# EAGLE schematic CurrentController (EAGLE 6.6.0)

## Sheet 1 of 4
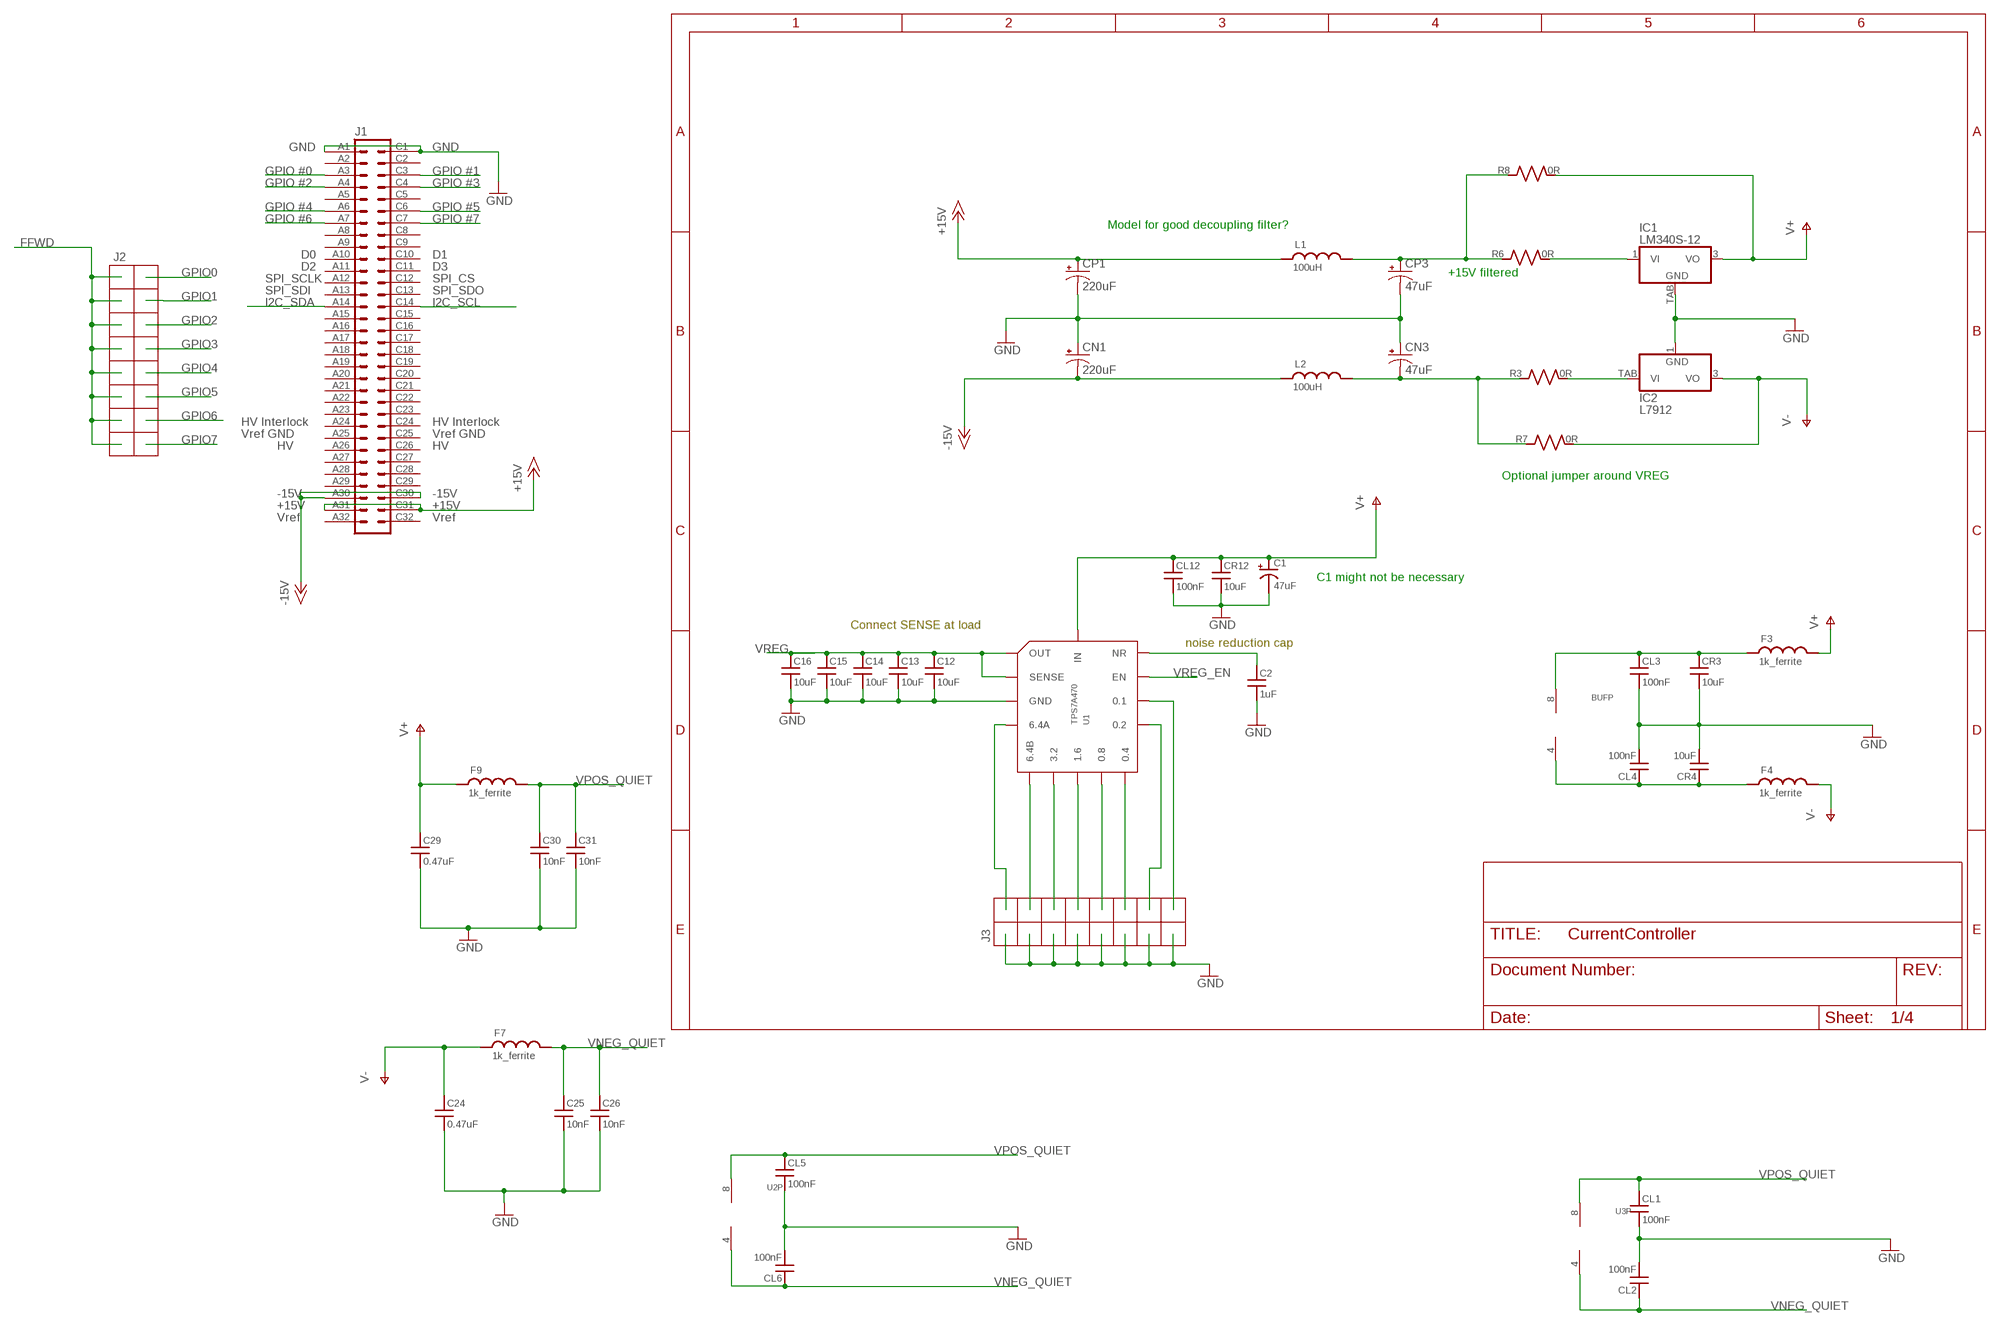
[diagram p0: schematic, sheet 1]

### Parts
BUF  AD8676  DUAL-OPAMP-AD8676_MSOP  [MSOP08]
C1  47uF  C_POL_SMDCPOL_1206  [C_POL_1206]
C2  1uF  C_MLCC_SMDCMLCC_0603  [C_MLCC_0603]
C12  10uF  C_MLCC_SMDCMLCC_0805  [C_MLCC_0805]
C13  10uF  C_MLCC_SMDCMLCC_0805  [C_MLCC_0805]
C14  10uF  C_MLCC_SMDCMLCC_0805  [C_MLCC_0805]
C15  10uF  C_MLCC_SMDCMLCC_0805  [C_MLCC_0805]
C16  10uF  C_MLCC_SMDCMLCC_0805  [C_MLCC_0805]
C24  0.47uF  C_MLCC_SMDCMLCC_0612  [C_MLCC_0612]
C25  10nF  C_MLCC_SMDCMLCC_0306  [C_MLCC_0306]
C26  10nF  C_MLCC_SMDCMLCC_0306  [C_MLCC_0306]
C29  0.47uF  C_MLCC_SMDCMLCC_0612  [C_MLCC_0612]
C30  10nF  C_MLCC_SMDCMLCC_0306  [C_MLCC_0306]
C31  10nF  C_MLCC_SMDCMLCC_0306  [C_MLCC_0306]
CL1  100nF  C_MLCC_SMDCMLCC_0603  [C_MLCC_0603]
CL2  100nF  C_MLCC_SMDCMLCC_0603  [C_MLCC_0603]
CL3  100nF  C_MLCC_SMDCMLCC_0603  [C_MLCC_0603]
CL4  100nF  C_MLCC_SMDCMLCC_0603  [C_MLCC_0603]
CL5  100nF  C_MLCC_SMDCMLCC_0603  [C_MLCC_0603]
CL6  100nF  C_MLCC_SMDCMLCC_0603  [C_MLCC_0603]
CL12  100nF  C_MLCC_SMDCMLCC_0603  [C_MLCC_0603]
CN1  220uF  CPOL-USF  [PANASONIC_F]
CN3  47uF  CPOL-USCT7343  [CT7343]
CP1  220uF  CPOL-USF  [PANASONIC_F]
CP3  47uF  CPOL-USCT7343  [CT7343]
CR3  10uF  C_MLCC_SMDCMLCC_0805  [C_MLCC_0805]
CR4  10uF  C_MLCC_SMDCMLCC_0805  [C_MLCC_0805]
CR12  10uF  C_MLCC_SMDCMLCC_0805  [C_MLCC_0805]
F3  1k_ferrite  L_FERRITE_SMDLFERRITE_0603  [L_FERRITE_0603]
F4  1k_ferrite  L_FERRITE_SMDLFERRITE_0603  [L_FERRITE_0603]
F7  1k_ferrite  L_FERRITE_SMDLFERRITE_0603  [L_FERRITE_0603]
F9  1k_ferrite  L_FERRITE_SMDLFERRITE_0603  [L_FERRITE_0603]
IC1  LM340S-12  [TO263-3]
IC2  L7912  [TO223-3]
J1  VG64C  [VG64-CUTOUT]
J2  2X8_LOW_PROFILE_JUMPER  [2X8_LOW_PROFILE_JUMPER_MATRIX]
J3  2X8_LOW_PROFILE_JUMPER  [2X8_LOW_PROFILE_JUMPER_MATRIX]
L1  100uH  WURTH_74477020  [WURTH_1280]
L2  100uH  WURTH_74477020  [WURTH_1280]
R3  0R  R_SMDR1206  [R_1206]
R6  0R  R_SMDR1206  [R_1206]
R7  0R  R_SMDR1206  [R_1206]
R8  0R  R_SMDR1206  [R_1206]
U1  TPS7A470  [S-PVQFN-N20]
U2  AD8676  DUAL-OPAMP-AD8676_MSOP  [MSOP08]
U3  AD8676  DUAL-OPAMP-AD8676_MSOP  [MSOP08]

### Nets
+15V: CP1.+ J1.A31 J1.C31 L1.P$1
-15V: CN1.- J1.A30 J1.C30 L2.P$1
FFWD: J2.P$1 J2.P$3 J2.P$5 J2.P$7 J2.P$9 J2.P$11 J2.P$13 J2.P$15 ; also sheet 2
GND: C1.P$2(-) C2.P$2 C12.P$2 C13.P$2 C14.P$2 C15.P$2 C16.P$2 C24.P$2 C25.P$2 C26.P$2 C29.P$2 C30.P$2 C31.P$2 CL1.P$2 CL2.P$2 CL3.P$2 CL4.P$2 CL5.P$2 CL6.P$2 CL12.P$2 CN1.+ CN3.+ CP1.- CP3.- CR3.P$2 CR4.P$2 CR12.P$2 IC1.TAB(GND) IC2.1(GND) J1.A1 J1.C1 J3.P$1 J3.P$3 J3.P$5 J3.P$7 J3.P$9 J3.P$11 J3.P$13 J3.P$15 U1.2(GND) U1.7(GND) U1.17(GND) U1.18(GND) U1.19(GND) U1.EXP(GND) ; also sheet 2,3,4
GPIO0: J1.A3 J2.P$2
GPIO1: J1.C3 J2.P$4
GPIO2: J1.A4 J2.P$6
GPIO3: J1.C4 J2.P$8
GPIO4: J1.A6 J2.P$10
GPIO5: J1.C6 J2.P$12
GPIO6: J1.A7 J2.P$14
GPIO7: J1.C7 J2.P$16
N$19: J3.P$2 U1.4(6.4A)
N$24: IC2.TAB(VI) R3.P$2
N$26: IC1.1(VI) R6.P$2
N$27: J3.P$4 U1.5(6.4B)
N$30: CN3.- L2.P$2 R3.P$1 R7.P$1
N$31: J3.P$6 U1.6(3.2)
N$32: CP3.+ L1.P$2 R6.P$1 R8.P$1
N$34: J3.P$8 U1.8(1.6)
N$36: BUF.4(P:V-) CL4.P$1 CR4.P$1 F4.P$1
N$37: BUF.8(P:V+) CL3.P$1 CR3.P$1 F3.P$1
N$39: J3.P$10 U1.9(0.8)
N$41: J3.P$12 U1.10(0.4)
N$43: J3.P$14 U1.11(0.2)
N$44: J3.P$16 U1.12(0.1)
N$45: C2.P$1 U1.14(NR)
SCL: J1.C14 ; also sheet 4
SDA: J1.A14 ; also sheet 4
V+: C1.P$1(+) C29.P$1 CL12.P$1 CR12.P$1 F3.P$2 F9.P$1 IC1.3(VO) R8.P$2 U1.15(IN) U1.16(IN) ; also sheet 3,4
V-: C24.P$1 F4.P$2 F7.P$1 IC2.3(VO) R7.P$2 ; also sheet 3,4
VNEG_QUIET: C25.P$1 C26.P$1 CL2.P$1 CL6.P$1 F7.P$2 U2.4(P:V-) U3.4(P:V-) ; also sheet 2
VPOS_QUIET: C30.P$1 C31.P$1 CL1.P$1 CL5.P$1 F9.P$2 U2.8(P:V+) U3.8(P:V+) ; also sheet 2
VREG: C12.P$1 C13.P$1 C14.P$1 C15.P$1 C16.P$1 U1.1(OUT) U1.3(SENSE) U1.20(OUT) ; also sheet 2,3
VREG_EN: U1.13(EN) ; also sheet 4
Unconnected: J1.A2 J1.A5 J1.A8 J1.A9 J1.A10 J1.A11 J1.A12 J1.A13 J1.A15 J1.A16 J1.A17 J1.A18 J1.A19 J1.A20 J1.A21 J1.A22 J1.A23 J1.A24 J1.A25 J1.A26 J1.A27 J1.A28 J1.A29 J1.A32 J1.C2 J1.C5 J1.C8 J1.C9 J1.C10 J1.C11 J1.C12 J1.C13 J1.C15 J1.C16 J1.C17 J1.C18 J1.C19 J1.C20 J1.C21 J1.C22 J1.C23 J1.C24 J1.C25 J1.C26 J1.C27 J1.C28 J1.C29 J1.C32

### Notes on the sheet
- Model for good decoupling filter?
- +15V filtered
- Optional jumper around VREG
- C1 might not be necessary
- Connect SENSE at load
- noise reduction cap

## Sheet 2 of 4
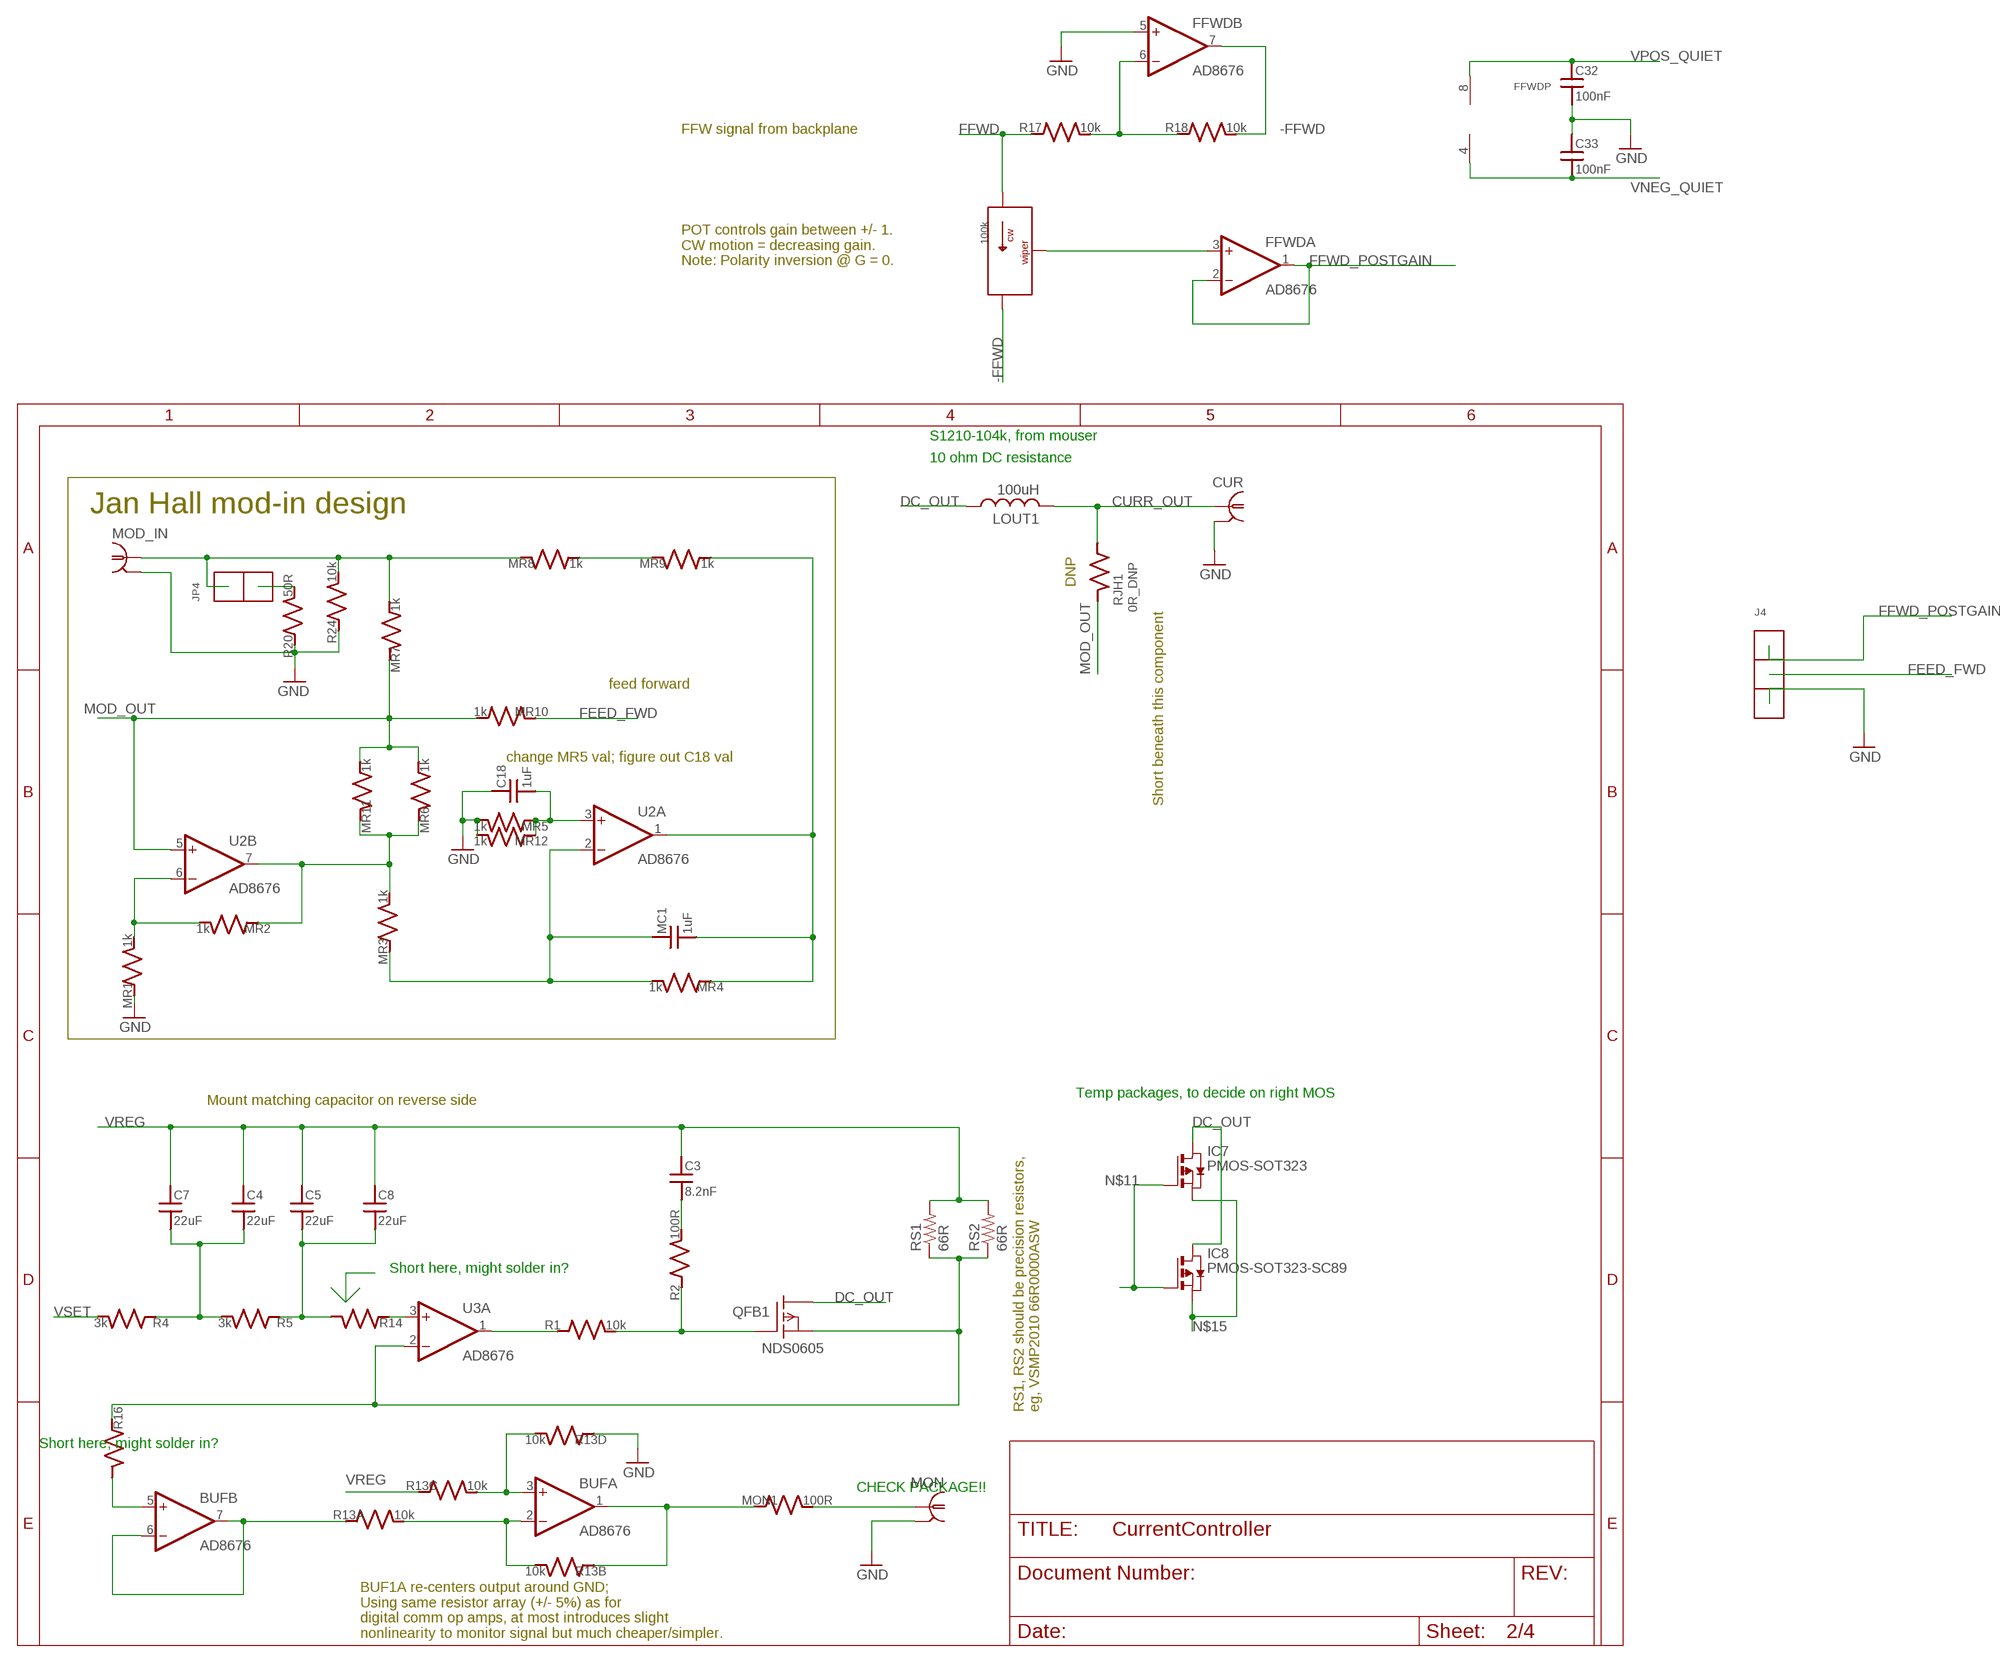
[diagram p1: schematic, sheet 2]

### Parts
C3  8.2nF  C_MLCC_SMDCMLCC_0603  [C_MLCC_0603]
C4  22uF  C_MLCC_SMDCMLCC_0805  [C_MLCC_0805]
C5  22uF  C_MLCC_SMDCMLCC_0805  [C_MLCC_0805]
C7  22uF  C_MLCC_SMDCMLCC_0805  [C_MLCC_0805]
C8  22uF  C_MLCC_SMDCMLCC_0805  [C_MLCC_0805]
C18  1uF  C_MLCC_SMDCMLCC_0603  [C_MLCC_0603]
C32  100nF  C_MLCC_SMDCMLCC_0603  [C_MLCC_0603]
C33  100nF  C_MLCC_SMDCMLCC_0603  [C_MLCC_0603]
CUR  BNC-H  [BNC90]
FFWD  AD8676  DUAL-OPAMP-AD8676_MSOP  [MSOP08]
IC7  PMOS-SOT323  [SOT323]
IC8  PMOS-SOT323-SC89  [SC-89]
J4  1X3_LOW_PROFILE_JUMPER  [1X3_LOW_PROFILE]
JP4  1X2_LOW_PROFILE_JUMPER  [1X2_LOW_PROFILE]
LOUT1  100uH  L-USL3225P  [L3225P]
MC1  1uF  C_MLCC_SMDCMLCC_0603  [C_MLCC_0603]
MOD_IN  BNC-H  [BNC90]
MON  UMC  [UMC]
MON1  100R  R_SMDR0603  [R_0603]
MR1  1k  R_SMDR0805  [R_0805]
MR2  1k  R_SMDR0805  [R_0805]
MR3  1k  R_SMDR0805  [R_0805]
MR4  1k  R_SMDR0805  [R_0805]
MR5  1k  R_SMDR0805  [R_0805]
MR6  1k  R_SMDR0805  [R_0805]
MR7  1k  R_SMDR0805  [R_0805]
MR8  1k  R_SMDR0805  [R_0805]
MR9  1k  R_SMDR0805  [R_0805]
MR10  1k  R_SMDR0805  [R_0805]
MR11  1k  R_SMDR0805  [R_0805]
MR12  1k  R_SMDR0805  [R_0805]
QFB1  NDS0605  [SOT-23]
R1  10k  R_SMDR0603  [R_0603]
R2  100R  R_SMDR0603  [R_0603]
R4  3k  R_SMDR0603  [R_0603]
R5  3k  R_SMDR0603  [R_0603]
R13  10k  R_ARRAY  [742_ARRAY]
R14  R_SMDR0603  [R_0603]
R16  R_SMDR0603  [R_0603]
R17  10k  R_SMDR0603  [R_0603]
R18  10k  R_SMDR0603  [R_0603]
R20  50R  R_SMDR0805  [R_0805]
R24  10k  R_SMDR0603  [R_0603]
RJH1  0R_DNP  R_SMDR0603  [R_0603]
RS1  66R  R-US_R2010  [R2010]
RS2  66R  R-US_R2010  [R2010]
T1  100k  BOURNS-3006P  [3006P]

### Nets
-FFWD: FFWD.7(B:OUT) R18.P$2 T1.P$3
CURR_OUT: CUR.1 LOUT1.2 RJH1.P$1
DC_OUT: IC7.3(D) IC8.P$3(D) LOUT1.1 QFB1.3(D)
FEED_FWD: J4.P2 MR10.P$1
FFWD: R17.P$1 T1.P$1 ; also sheet 1
FFWD_POSTGAIN: FFWD.1(A:OUT) FFWD.2(A:-IN) J4.P1
GND: C18.P$1 C32.P$2 C33.P$1 CUR.2 FFWD.5(B:+IN) J4.P3 MOD_IN.2 MON.P$2 MON.P$3 MR1.P$1 MR5.P$2 MR12.P$2 R13.P$7 R20.P$1 R24.P$1 ; also sheet 1,3,4
MOD_OUT: MR6.P$2 MR7.P$1 MR10.P$2 MR11.P$2 RJH1.P$2 U2.5(B:+IN)
MODIN_B: JP4.1 MOD_IN.1 MR7.P$2 MR8.P$1 R24.P$2
MON: BUF.1(A:OUT) MON1.P$1 R13.P$3
MON_MON: MON1.P$2 MON.P$1
N$1: MR8.P$2 MR9.P$1
N$4: BUF.6(B:-IN) BUF.7(B:OUT) R13.P$1
N$6: BUF.5(B:+IN) R16.P$2
N$7: FFWD.3(A:+IN) T1.P$2
N$8: C4.P$2 C7.P$2 R4.P$1 R5.P$2
N$9: C5.P$2 C8.P$2 R5.P$1 R14.P$2
N$10: R1.P$1 U3.1(A:OUT)
N$11: IC7.1(G) IC8.P$1(G) QFB1.1(G) R1.P$2 R2.P$1
N$12: R14.P$1 U3.3(A:+IN)
N$13: C3.P$2 R2.P$2
N$14: BUF.2(A:-IN) R13.P$2 R13.P$4
N$15: IC7.2(S) IC8.P$2(S) QFB1.2(S) R16.P$1 RS1.1 RS2.1 U3.2(A:-IN)
N$17: BUF.3(A:+IN) R13.P$6 R13.P$8
N$18: MR1.P$2 MR2.P$2 U2.6(B:-IN)
N$20: MR2.P$1 MR3.P$2 MR6.P$1 MR11.P$1 U2.7(B:OUT)
N$21: C18.P$2 MR5.P$1 MR12.P$1 U2.3(A:+IN)
N$23: MC1.P$2 MR4.P$1 MR9.P$2 U2.1(A:OUT)
N$25: MC1.P$1 MR3.P$1 MR4.P$2 U2.2(A:-IN)
N$35: JP4.2 R20.P$2
N$38: FFWD.6(B:-IN) R17.P$2 R18.P$1
VNEG_QUIET: C33.P$2 FFWD.4(P:V-) ; also sheet 1
VPOS_QUIET: C32.P$1 FFWD.8(P:V+) ; also sheet 1
VREG: C3.P$1 C4.P$1 C5.P$1 C7.P$1 C8.P$1 R13.P$5 RS1.2 RS2.2 ; also sheet 1,3
VSET: R4.P$2 ; also sheet 3

### Notes on the sheet
- FFW signal from backplane
- POT controls gain between +/- 1.
  CW motion = decreasing gain.
  Note: Polarity inversion @ G = 0.
- S1210-104k, from mouser
- 10 ohm DC resistance
- Jan Hall mod-in design
- DNP
- feed forward
- change MR5 val; figure out C18 val
- Short beneath this component
- Temp packages, to decide on right MOS
- Mount matching capacitor on reverse side
- Short here, might solder in?
- RS1, RS2 should be precision resistors,
  eg, VSMP2010 66R0000ASW
- Short here, might solder in?
- CHECK PACKAGE!!
- BUF1A re-centers output around GND;
  Using same resistor array (+/- 5%) as for 
  digital comm op amps, at most introduces slight 
  nonlinearity to monitor signal but much cheaper/simpler.

## Sheet 3 of 4
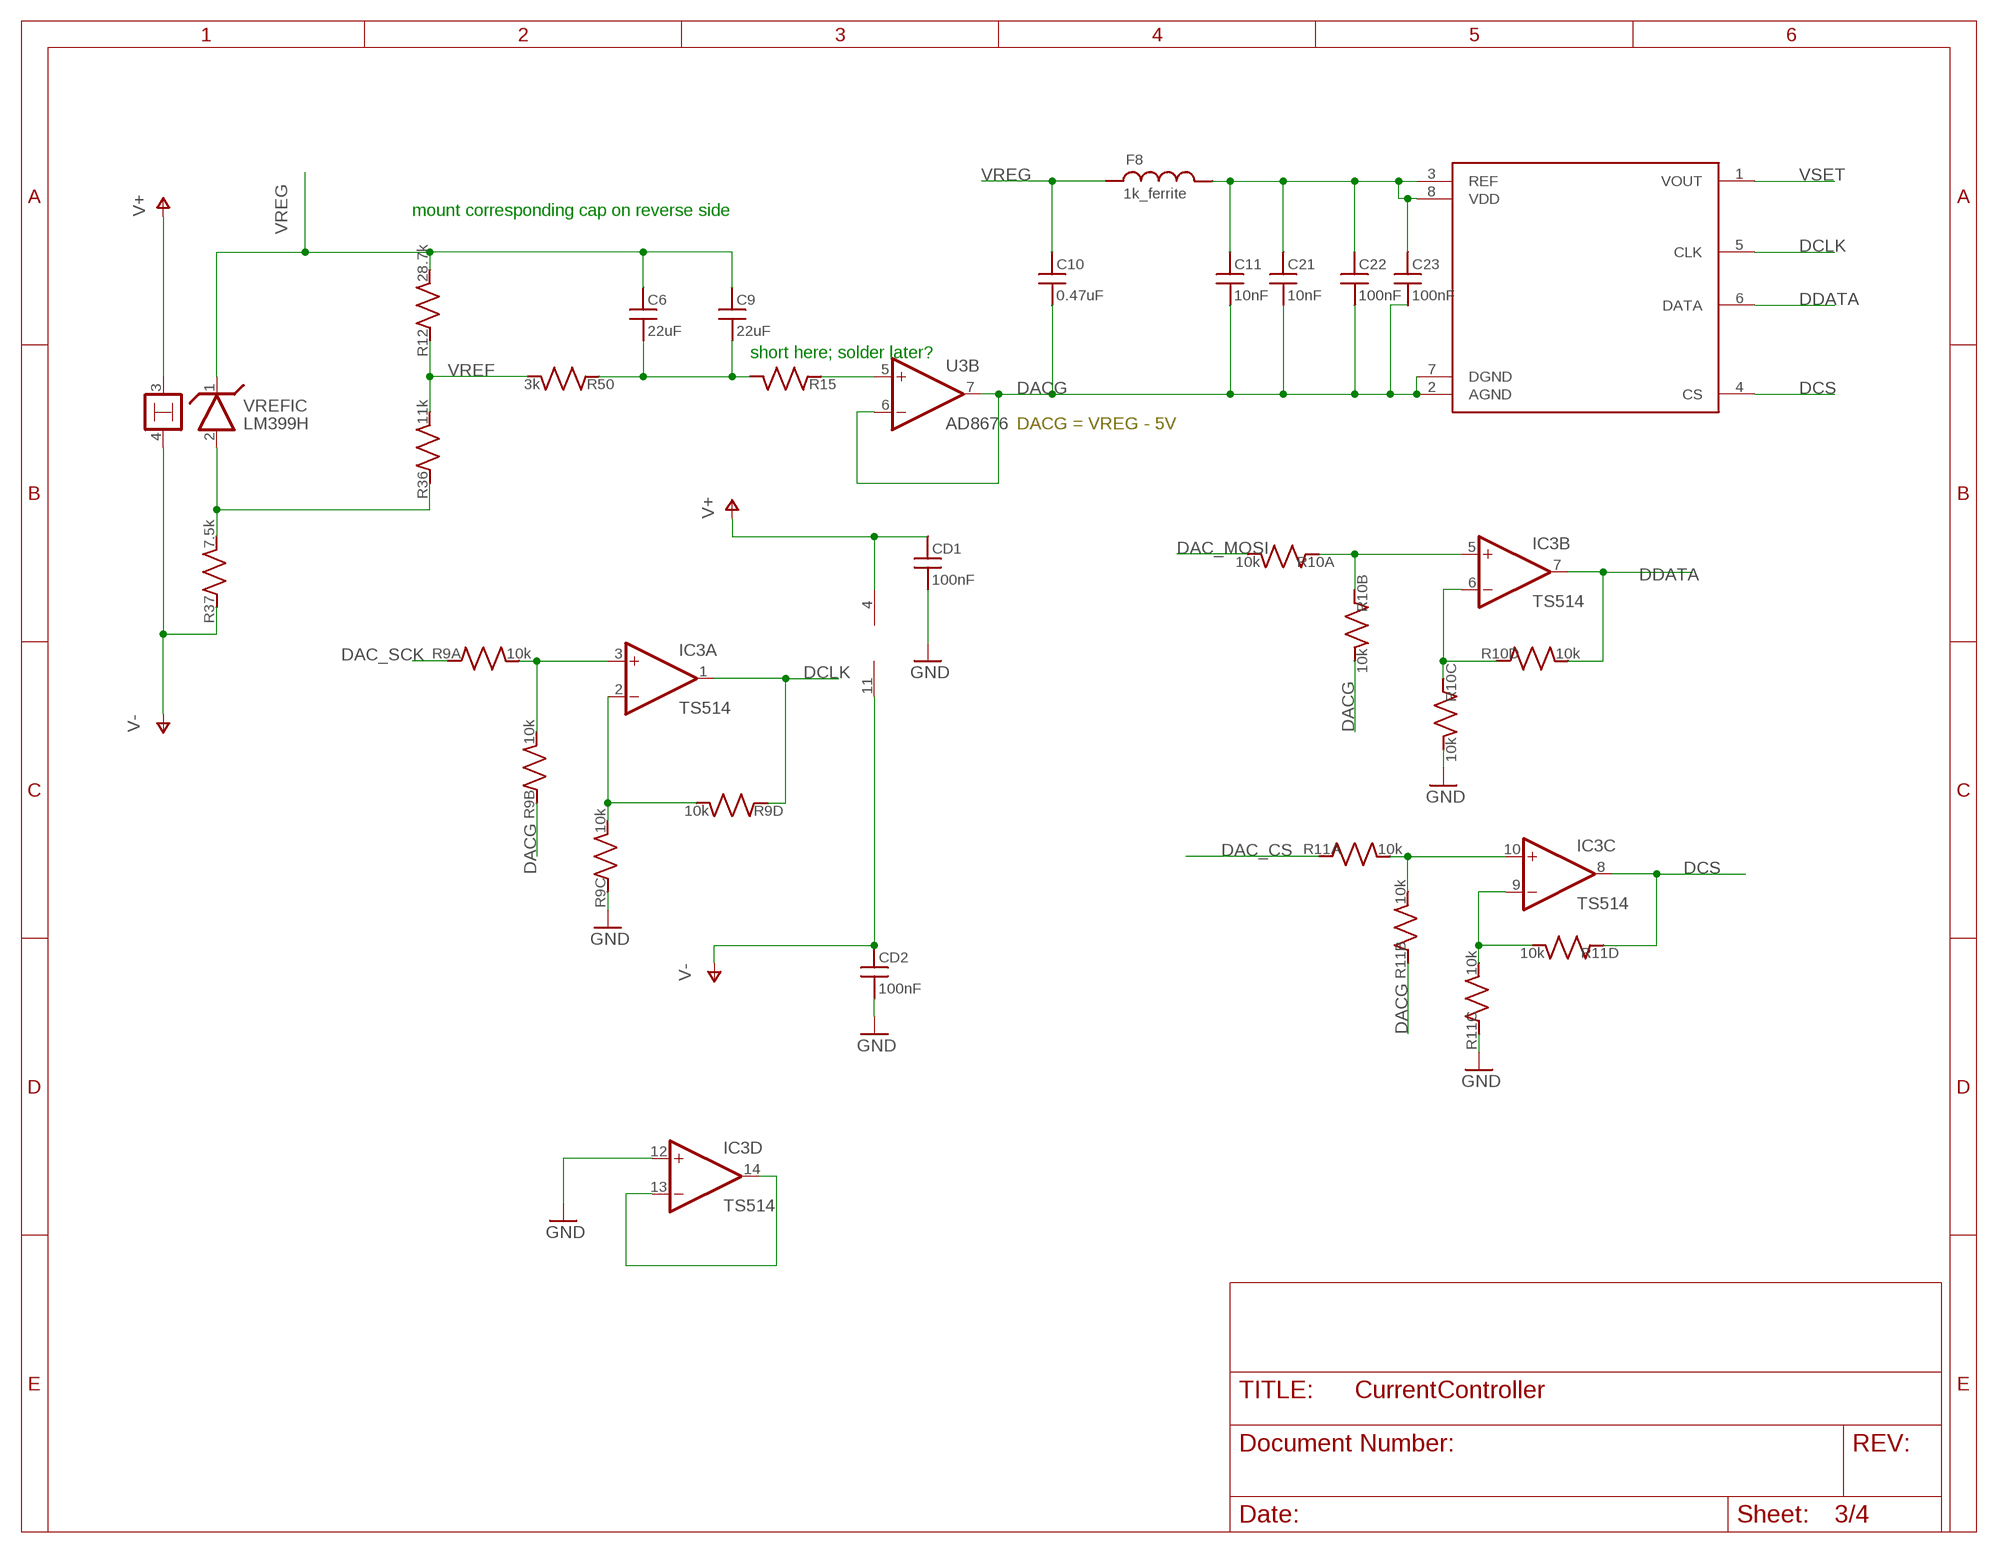
[diagram p2: schematic, sheet 3]

### Parts
C6  22uF  C_MLCC_SMDCMLCC_0805  [C_MLCC_0805]
C9  22uF  C_MLCC_SMDCMLCC_0805  [C_MLCC_0805]
C10  0.47uF  C_MLCC_SMDCMLCC_0612  [C_MLCC_0612]
C11  10nF  C_MLCC_SMDCMLCC_0306  [C_MLCC_0306]
C21  10nF  C_MLCC_SMDCMLCC_0306  [C_MLCC_0306]
C22  100nF  C_MLCC_SMDCMLCC_0603  [C_MLCC_0603]
C23  100nF  C_MLCC_SMDCMLCC_0603  [C_MLCC_0603]
CD1  100nF  C_MLCC_SMDCMLCC_0603  [C_MLCC_0603]
CD2  100nF  C_MLCC_SMDCMLCC_0603  [C_MLCC_0603]
DAC1  AD5541  [SOIC-8]
F8  1k_ferrite  L_FERRITE_SMDLFERRITE_0603  [L_FERRITE_0603]
IC3  TS514  4AMP_P4+11D  [SO14]
R9  10k  R_ARRAY  [742_ARRAY]
R10  10k  R_ARRAY  [742_ARRAY]
R11  10k  R_ARRAY  [742_ARRAY]
R12  28.7k  R_SMDR0603  [R_0603]
R15  R_SMDR0603  [R_0603]
R36  11k  R_SMDR0603  [R_0603]
R37  7.5k  R_SMDR0603  [R_0603]
R50  3k  R_SMDR0603  [R_0603]
VREFIC  LM399H  [TO39/4]

### Nets
DAC_CS: R11.P$1 ; also sheet 4
DAC_MOSI: R10.P$2 ; also sheet 4
DAC_SCK: R9.P$1 ; also sheet 4
DACG: C10.P$2 C11.P$2 C21.P$2 C22.P$2 C23.P$2 DAC1.2(AGND) DAC1.7(DGND) R9.P$3 R10.P$4 R11.P$3 U3.6(B:-IN) U3.7(B:OUT)
DCLK: DAC1.5(CLK) IC3.1(A:OUT) R9.P$7
DCS: DAC1.4(CS) IC3.8(C:OUT) R11.P$7
DDATA: DAC1.6(DATA) IC3.7(B:OUT) R10.P$8
GND: CD1.P$2 CD2.P$2 IC3.12(D:+IN) R9.P$5 R10.P$6 R11.P$5 ; also sheet 1,2,4
N$3: IC3.9(C:-IN) R11.P$6 R11.P$8
N$16: IC3.2(A:-IN) R9.P$6 R9.P$8
N$28: R36.P$1 R37.P$2 VREFIC.2
N$29: R15.P$1 U3.5(B:+IN)
N$40: IC3.3(A:+IN) R9.P$2 R9.P$4
N$42: IC3.5(B:+IN) R10.P$1 R10.P$3
N$47: IC3.6(B:-IN) R10.P$5 R10.P$7
N$48: C6.P$2 C9.P$2 R15.P$2 R50.P$1
N$49: IC3.10(C:+IN) R11.P$2 R11.P$4
N$51: IC3.13(D:-IN) IC3.14(D:OUT)
V+: CD1.P$1 IC3.4(P:V+) VREFIC.3 ; also sheet 1,4
V-: CD2.P$1 IC3.11(P:V-) R37.P$1 VREFIC.4 ; also sheet 1,4
VREF: R12.P$1 R36.P$2 R50.P$2
VREG: C6.P$1 C9.P$1 C10.P$1 F8.P$1 R12.P$2 VREFIC.1 ; also sheet 1,2
VREG_DAC: C11.P$1 C21.P$1 C22.P$1 C23.P$1 DAC1.3(REF) DAC1.8(VDD) F8.P$2
VSET: DAC1.1(VOUT) ; also sheet 2

### Notes on the sheet
- mount corresponding cap on reverse side
- short here; solder later?
- DACG = VREG - 5V

## Sheet 4 of 4
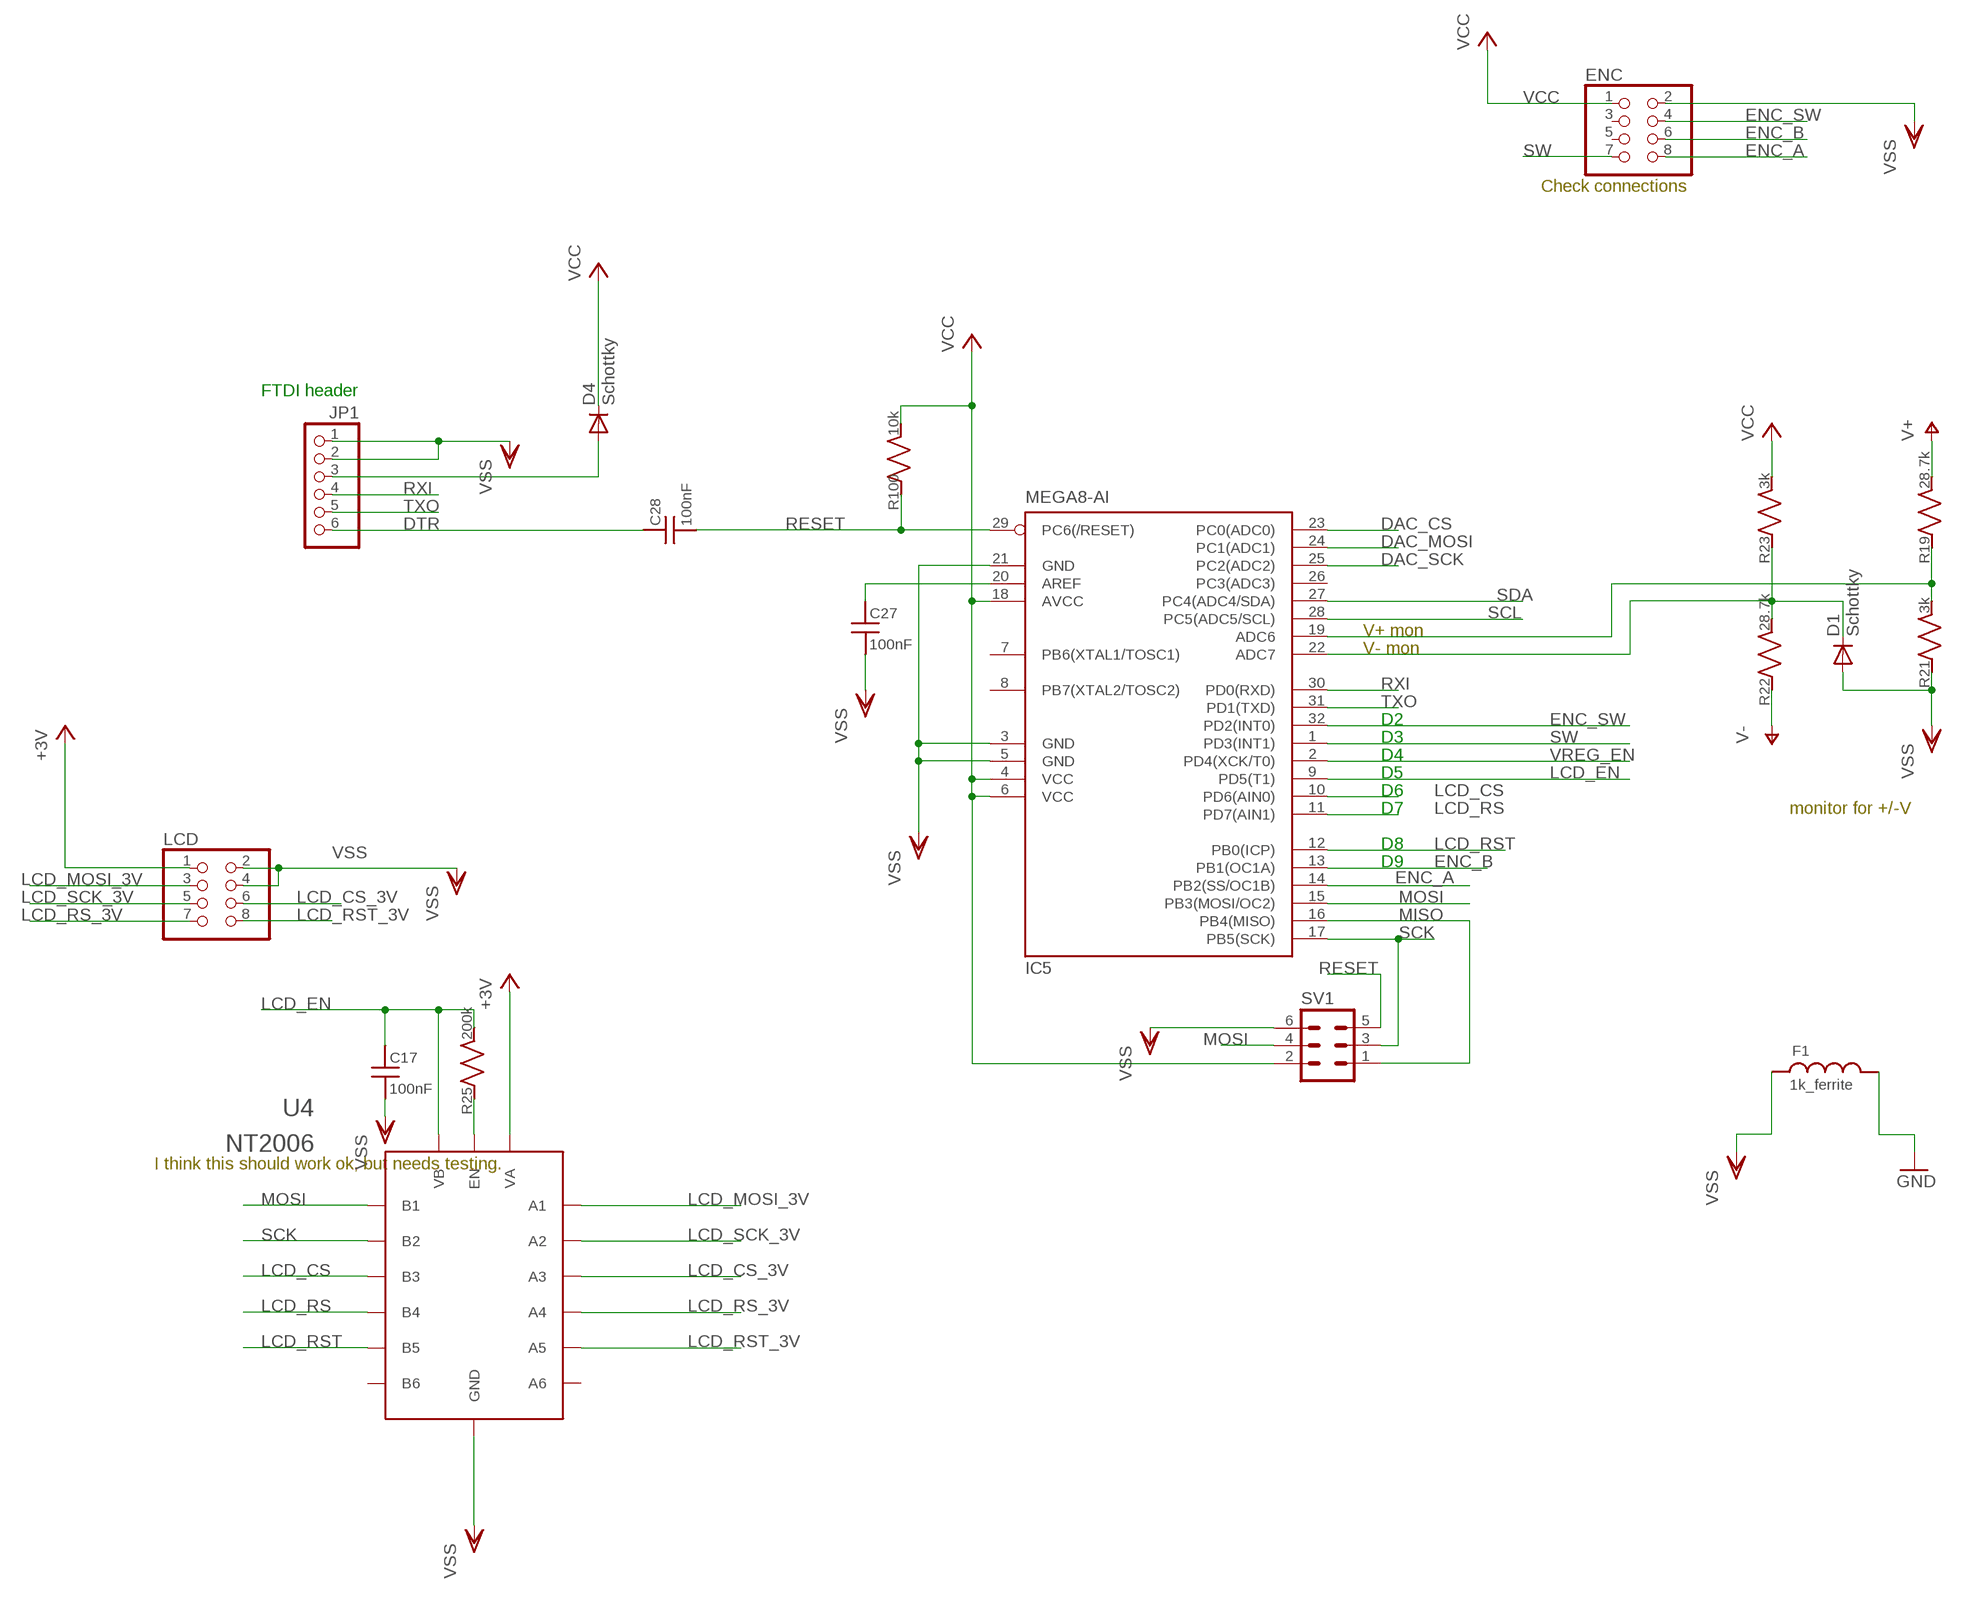
[diagram p3: schematic, sheet 4, part 1 of 2]
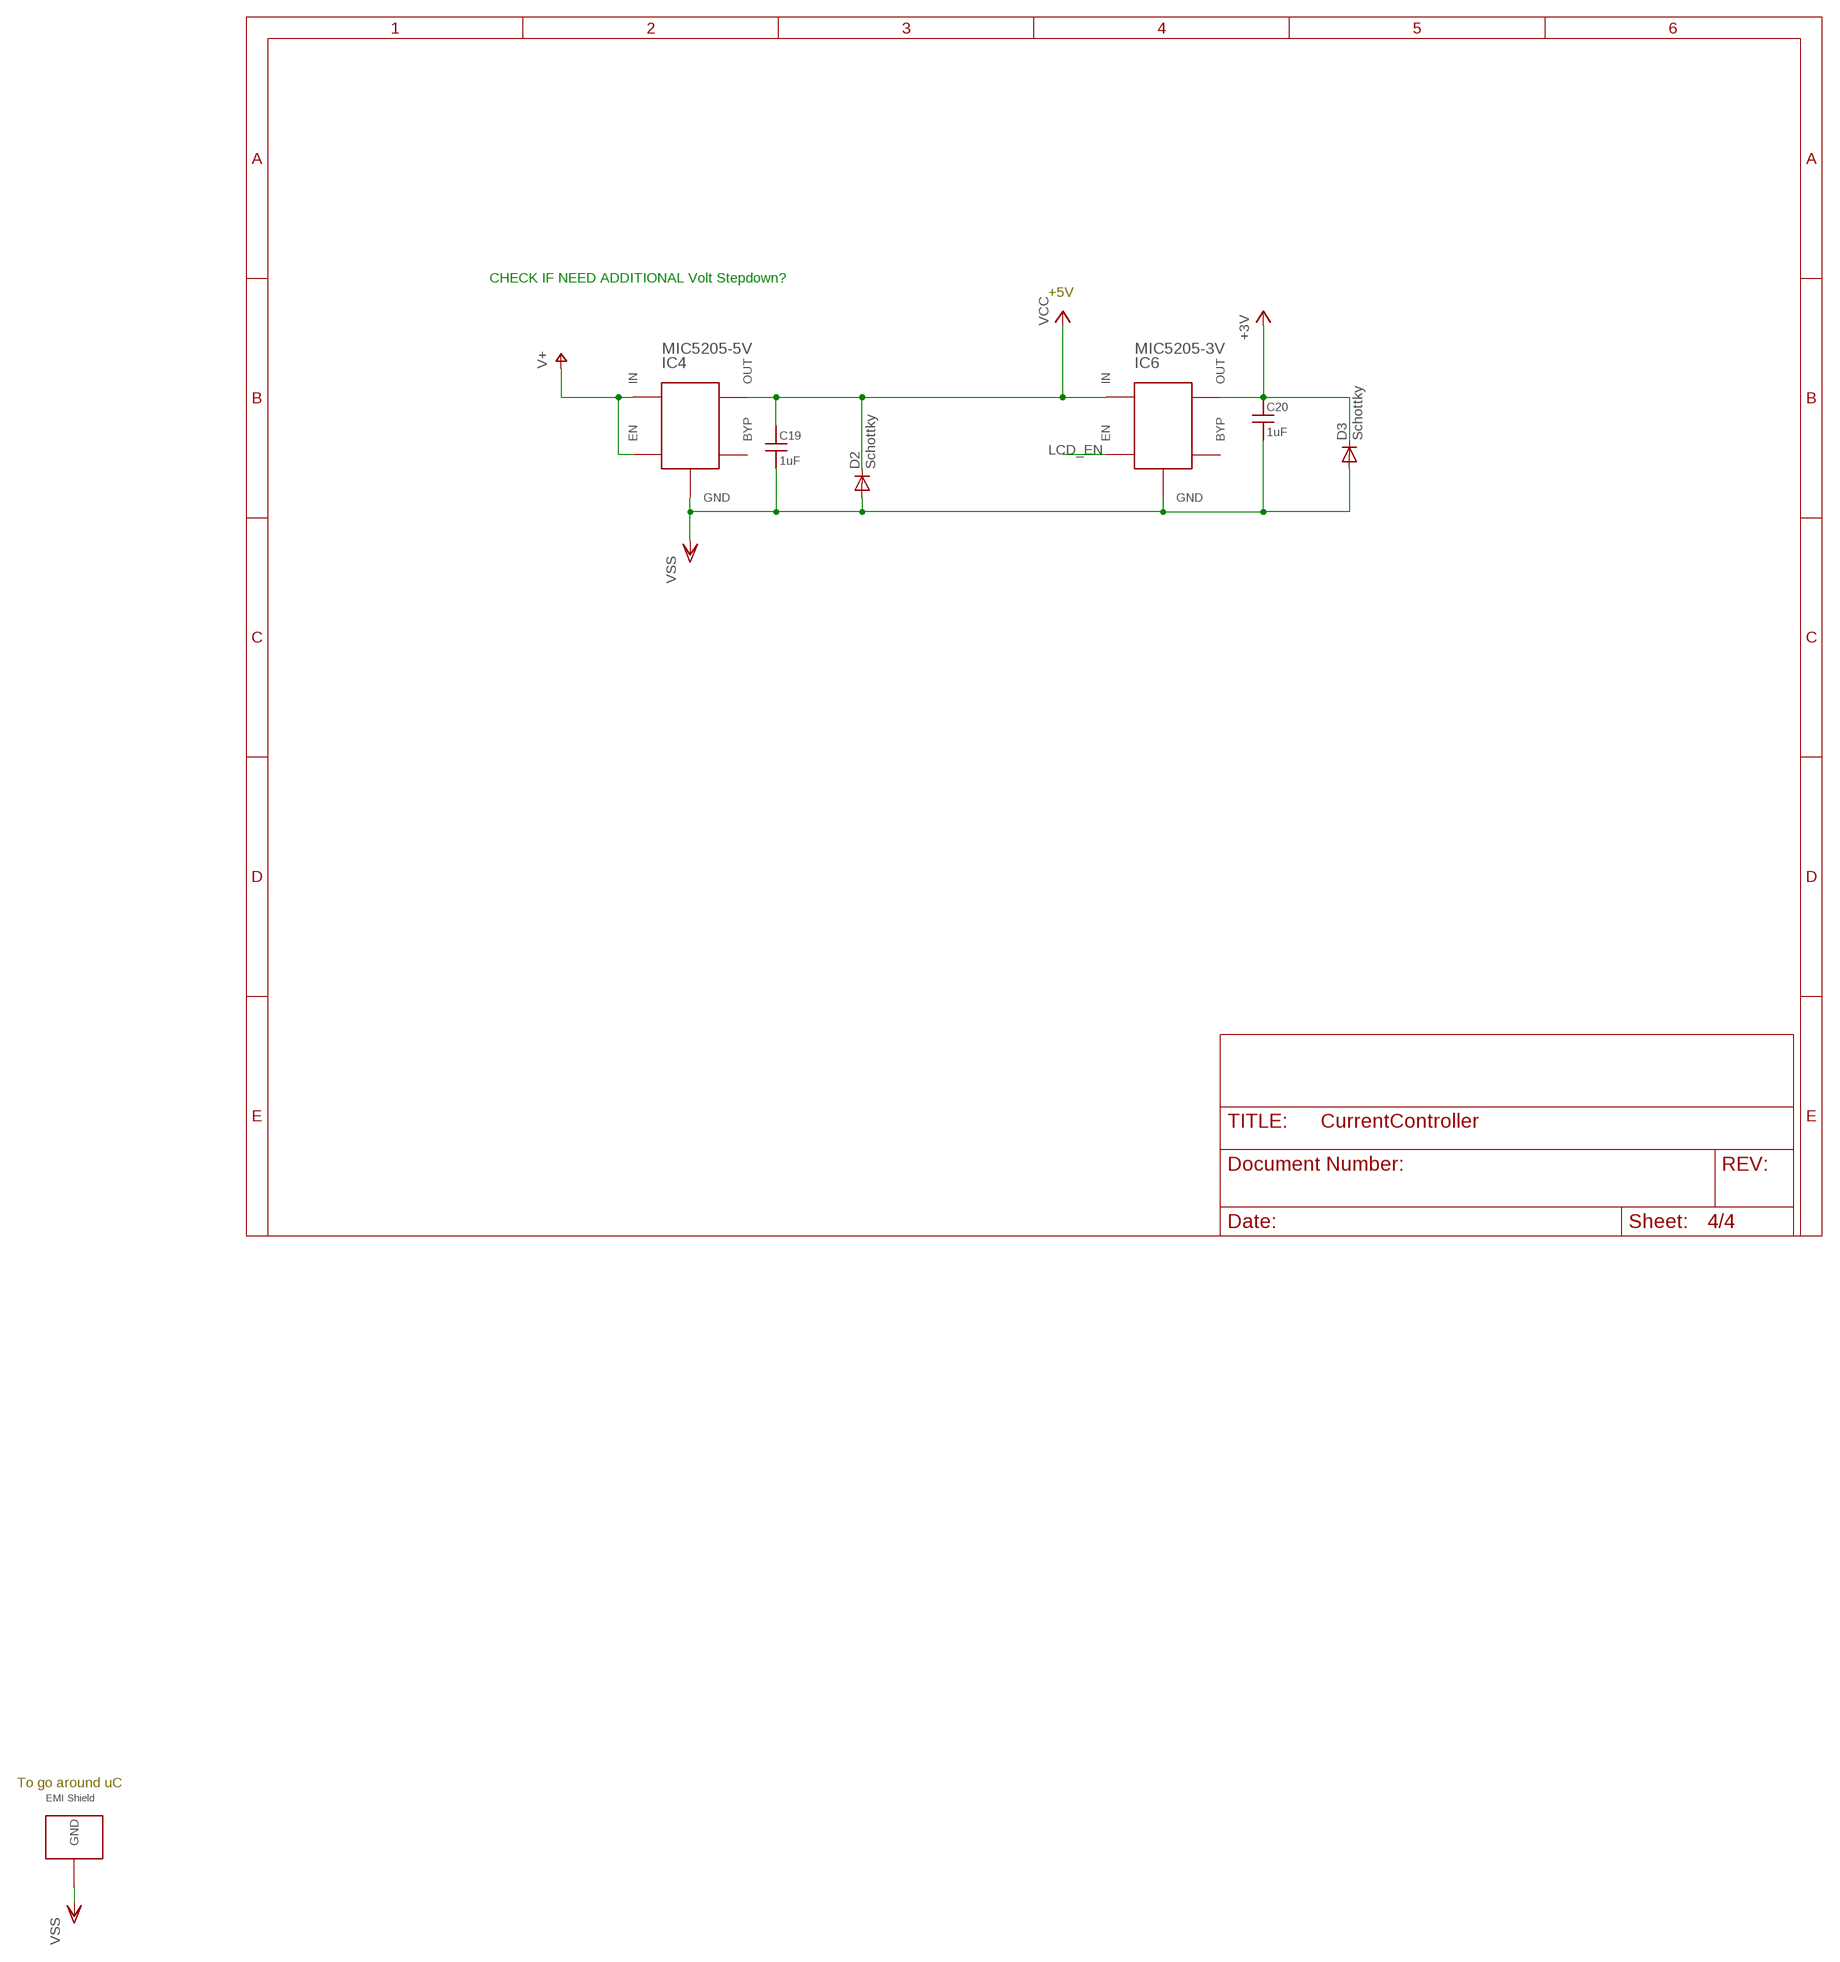
[diagram p4: schematic, sheet 4, part 2 of 2]

### Parts
C17  100nF  C_MLCC_SMDCMLCC_0603  [C_MLCC_0603]
C19  1uF  C_MLCC_SMDCMLCC_0603  [C_MLCC_0603]
C20  1uF  C_MLCC_SMDCMLCC_0603  [C_MLCC_0603]
C27  100nF  C_MLCC_SMDCMLCC_0603  [C_MLCC_0603]
C28  100nF  C_MLCC_SMDCMLCC_0603  [C_MLCC_0603]
D1  Schottky  DIODE-SOD523  [SOD523]
D2  Schottky  DIODE-SOD523  [SOD523]
D3  Schottky  DIODE-SOD523  [SOD523]
D4  Schottky  DIODE-SOD523  [SOD523]
ENC  PINHD-2X4-SHROUD  [ML08]
F1  1k_ferrite  L_FERRITE_SMDLFERRITE_0603  [L_FERRITE_0603]
IC4  MIC5205-5V  MIC5205  [SOT23-5L]
IC5  MEGA8-AI  [TQFP32-08]
IC6  MIC5205-3V  MIC5205  [SOT23-5L]
JP1  PINHD-1X6  [1X06]
LCD  PINHD-2X4-SHROUD  [ML08]
R19  28.7k  R_SMDR0603  [R_0603]
R21  3k  R_SMDR0603  [R_0603]
R22  28.7k  R_SMDR0603  [R_0603]
R23  3k  R_SMDR0603  [R_0603]
R25  200k  R_SMDR0603  [R_0603]
R100  10k  R_SMDR0603  [R_0603]
SV1  MA03-2  [MA03-2]
U4  NT2006  [HVQFN16]
U$5  WURTH_EMI  [WURTH_SHIELD]

### Nets
+3V: C20.P$1 D3.C IC6.5(OUT) LCD.1 U4.16(VA)
A6: IC5.19(ADC6) R19.P$1 R21.P$2
A7: D1.C IC5.22(ADC7) R22.P$2 R23.P$1
DAC_CS: IC5.23(PC0(ADC0)) ; also sheet 3
DAC_MOSI: IC5.24(PC1(ADC1)) ; also sheet 3
DAC_SCK: IC5.25(PC2(ADC2)) ; also sheet 3
DTR: C28.P$1 JP1.6
ENC_A: ENC.8 IC5.14(PB2(SS/OC1B))
ENC_B: ENC.6 IC5.13(PB1(OC1A))
ENC_SW: ENC.4 IC5.32(PD2(INT0))
GND: F1.P$2 ; also sheet 1,2,3
LCD_CS: IC5.10(PD6(AIN0)) U4.10(B3)
LCD_CS_3V: LCD.6 U4.3(A3)
LCD_EN: C17.P$1 IC5.9(PD5(T1)) IC6.3(EN) R25.P$2 U4.13(VB)
LCD_MOSI_3V: LCD.3 U4.1(A1)
LCD_RS: IC5.11(PD7(AIN1)) U4.9(B4)
LCD_RS_3V: LCD.7 U4.4(A4)
LCD_RST: IC5.12(PB0(ICP)) U4.8(B5)
LCD_RST_3V: LCD.8 U4.5(A5)
LCD_SCK_3V: LCD.5 U4.2(A2)
MISO: IC5.16(PB4(MISO)) SV1.1
MOSI: IC5.15(PB3(MOSI/OC2)) SV1.4 U4.12(B1)
N$2: D4.A JP1.3
N$5: C27.P$1 IC5.20(AREF)
N$22: R25.P$1 U4.14(EN)
RESET: C28.P$2 IC5.29(PC6(/RESET)) R100.P$1 SV1.5
RXI: IC5.30(PD0(RXD)) JP1.4
SCK: IC5.17(PB5(SCK)) SV1.3 U4.11(B2)
SCL: IC5.28(PC5(ADC5/SCL)) ; also sheet 1
SDA: IC5.27(PC4(ADC4/SDA)) ; also sheet 1
SW: ENC.7 IC5.1(PD3(INT1))
TXO: IC5.31(PD1(TXD)) JP1.5
V+: IC4.1(IN) IC4.3(EN) R19.P$2 ; also sheet 1,3
V-: R22.P$1 ; also sheet 1,3
VCC: C19.P$1 D2.C D4.C ENC.1 IC4.5(OUT) IC5.4(VCC) IC5.6(VCC) IC5.18(AVCC) IC6.1(IN) R23.P$2 R100.P$2 SV1.2
VREG_EN: IC5.2(PD4(XCK/T0)) ; also sheet 1
VSS: C17.P$2 C19.P$2 C20.P$2 C27.P$2 D1.A D2.A D3.A ENC.2 F1.P$1 IC4.2(GND) IC5.3(GND) IC5.5(GND) IC5.21(GND) IC6.2(GND) JP1.1 JP1.2 LCD.2 LCD.4 R21.P$1 SV1.6 U4.15(GND) U4.P$17(GND) U$5.P$1(GND) U$5.P$2(GND) U$5.P$3(GND) U$5.P$4(GND) U$5.P$5(GND) U$5.P$6(GND) U$5.P$7(GND) U$5.P$8(GND) U$5.P$9(GND) U$5.P$10(GND) U$5.P$11(GND) U$5.P$12(GND) U$5.P$13(GND) U$5.P$14(GND) U$5.P$15(GND) U$5.P$16(GND)
Unconnected: ENC.3 ENC.5 IC4.4(BYP) IC5.7(PB6(XTAL1/TOSC1)) IC5.8(PB7(XTAL2/TOSC2)) IC5.26(PC3(ADC3)) IC6.4(BYP) U4.6(A6) U4.7(B6)

### Notes on the sheet
- CHECK IF NEED ADDITIONAL Volt Stepdown?
- +5V
- Check connections
- FTDI header
- To go around uC
- V+ mon
- V- mon
- D2
- D3
- D4
- D5
- D6
- D7 | monitor for +/-V
- D8
- D9
- I think this should work ok, but needs testing.

## Library data of the parts
BUF FFWD U2 U3 = opamp-jqi:DUAL-OPAMP; PARTNO: AD8676ARMZ
C1 = jqi_passives:C_POL_SMD
C2 C18-C20 MC1 = jqi_passives:C_MLCC_SMD; PARTNO: CL10B105KA8NNNC
C3 = jqi_passives:C_MLCC_SMD; PARTNO: CL10B822KB8NNNC
C4-C9 = jqi_passives:C_MLCC_SMD; PARTNO: C2012X5R1E226M125AC
C10 C24 C29 = jqi_passives:C_MLCC_SMD; PARTNO: LLL31MR71E474MA01L
C11 C21 C25 C26 C30 C31 = jqi_passives:C_MLCC_SMD; PARTNO: 03063C103KAT2A
C12-C16 CR3 CR4 CR12 = jqi_passives:C_MLCC_SMD; PARTNO: CL21A106KAFN3NE
C17 C22 C23 C27 C28 C32 C33 CD1 CD2 CL1-CL6 CL12 = jqi_passives:C_MLCC_SMD; PARTNO: C1608X7R1E104K080AA
CN1 CP1 = rcl:CPOL-US: POLARIZED CAPACITOR, American symbol; PARTNO: EEE-1VA221UP
CN3 CP3 = rcl:CPOL-US: POLARIZED CAPACITOR, American symbol; PARTNO: T491D476M025AT
CUR MOD_IN = connector-jqi:BNC: BNC Connector.; DIGIKEY: A32260-ND; PARTNO: 5227161-7
D1-D4 = diode:DIODE-: DIODE; PARTNO: PMEG3005EB,115
DAC1 = misc-ics:AD5541; PARTNO: AD5541BRZ
ENC LCD = mcu-accessories:PINHD-2X4: PIN HEADER; PARTNO: 75869-132LF
F1 F3 F4 F7-F9 = jqi_passives:L_FERRITE_SMD; PARTNO: BLM18HG102SN1D
IC1 = linear:LM340?-*: Positive VOLTAGE REGULATOR Source: http://cache.national.com/ds/LM/LM340.pdf; PARTNO: LM340S-12/NOPB
IC2 = misc-ics:L7912; PARTNO: MC7912CD2TG
IC3 = linear:4AMP_P4+11: OP AMP; PARTNO: TS514AIDT
IC4 = regulator-jqi:MIC5205: 150mA Low noise LDO regulator; PARTNO: MIC5205-5.0YM5-TR
IC5 = atmel:MEGA8: MICROCONTROLLER 8 Kbytes FLASH, 1 kbytes SRAM, 512 bytes EEPROM, USART, 6-channel 10 bit ADC, 2-channel 8 bit ADC Pin compatible with Atmega48, ATMega88, ATMega168 Source: avr.lbr; MPN: ATMEGA8-16AU; OC_FARNELL: 9171371; OC_NEWARK: 73M8863; PARTNO: ATMEGA328P-AU
IC6 = regulator-jqi:MIC5205: 150mA Low noise LDO regulator; PARTNO: MIC5205-3.0YM5-TR
IC7 IC8 = semiconductor-jqi:PMOS-SOT323
J1 = connector-jqi:VG64: PCB EUROCARD, 64-pin type C/AC, 2.54 mm Typically use package VG64P.; PARTNO: 5650945-5
J2 J3 = Eurocard-HV-piezo-driver:2X8_LOW_PROFILE_JUMPER; DIGIKEY: NRPN082PAEN-RC; PARTNO: A3B-16PA-2DSA(71)
J4 = pinhead:1X3_LOW_PROFILE_JUMPER; PARTNO: NRPN031PAEN-RC
JP1 = pinhead:PINHD-1X6: PIN HEADER; PARTNO: 68000-406HLF
JP4 = Eurocard-HV-piezo-driver:1X2_LOW_PROFILE_JUMPER; PARTNO: NRPN021PAEN-RC
L1 L2 = jqi_passives:WURTH_74477020; PARTNO: 74477020
LOUT1 = rcl:L-US: INDUCTOR, American symbol; PARTNO: CBC3225T680KR
MON = connector-jqi:UMC: UMC "ultra-miniature" Coaxial connector.; PARTNO: 1909763-1
MON1 R2 = jqi_passives:R_SMD; PARTNO: ERJ-3EKF1000V
MR1-MR12 = jqi_passives:R_SMD; PARTNO: ERA-6ARB102V
QFB1 = misc-ics:NDS0605; PARTNO: *
R1 R17 R18 R24 R100 = jqi_passives:R_SMD; PARTNO: ERJ-3EKF1002V
R3 R6-R8 = jqi_passives:R_SMD; PARTNO: ERJ-8GEY0R00V
R4 R5 R21 R23 R50 = jqi_passives:R_SMD; PARTNO: ERJ-3EKF3001V
R9-R11 R13 = jqi_passives:R_ARRAY; PARTNO: 742C083103JP
R12 R19 R22 = jqi_passives:R_SMD; PARTNO: ERJ-3EKF2872V
R14-R16 RJH1 = jqi_passives:R_SMD
R20 = jqi_passives:R_SMD; PARTNO: ERJ-6ENF49R9V
R25 = jqi_passives:R_SMD; PARTNO: ERJ-3EKF2003V
R36 = jqi_passives:R_SMD; PARTNO: ERJ-3EKF1102V
R37 = jqi_passives:R_SMD; PARTNO: ERJ-3EKF7501V
RS1 RS2 = rcl:R-US_: RESISTOR, American symbol
SV1 = con-lstb:MA03-2: PIN HEADER; OC_FARNELL: unknown; OC_NEWARK: unknown; PARTNO: 67996-406HLF
T1 = rlc-jqi:BOURNS-3006P: Bourns 3006 series trimpots; PARTNO: 3006P-1-104LF
U1 = regulator-jqi:TPS7A470: Ultra-low noise LDO regulator, variable programmable output, 36V; PARTNO: TPS7A4701RGWT
U4 = semiconductor-jqi:NT2006: 6 CH level shifter, eg, http://www.nxp.com/documents/data_sheet/NVT2003_04_06.pdf; PARTNO: NVT2006BS,118
U$5 = mcu-accessories:WURTH_EMI: Wurth electronics 20mm x 20mm EMI shield; PN 36103205 Digikey 732-2486-ND + mating shield PN 732-2488-ND; PARTNO: 36103205
VREFIC = linear:LM399H: Precision Z DIODE; PARTNO: LM399H#PBF